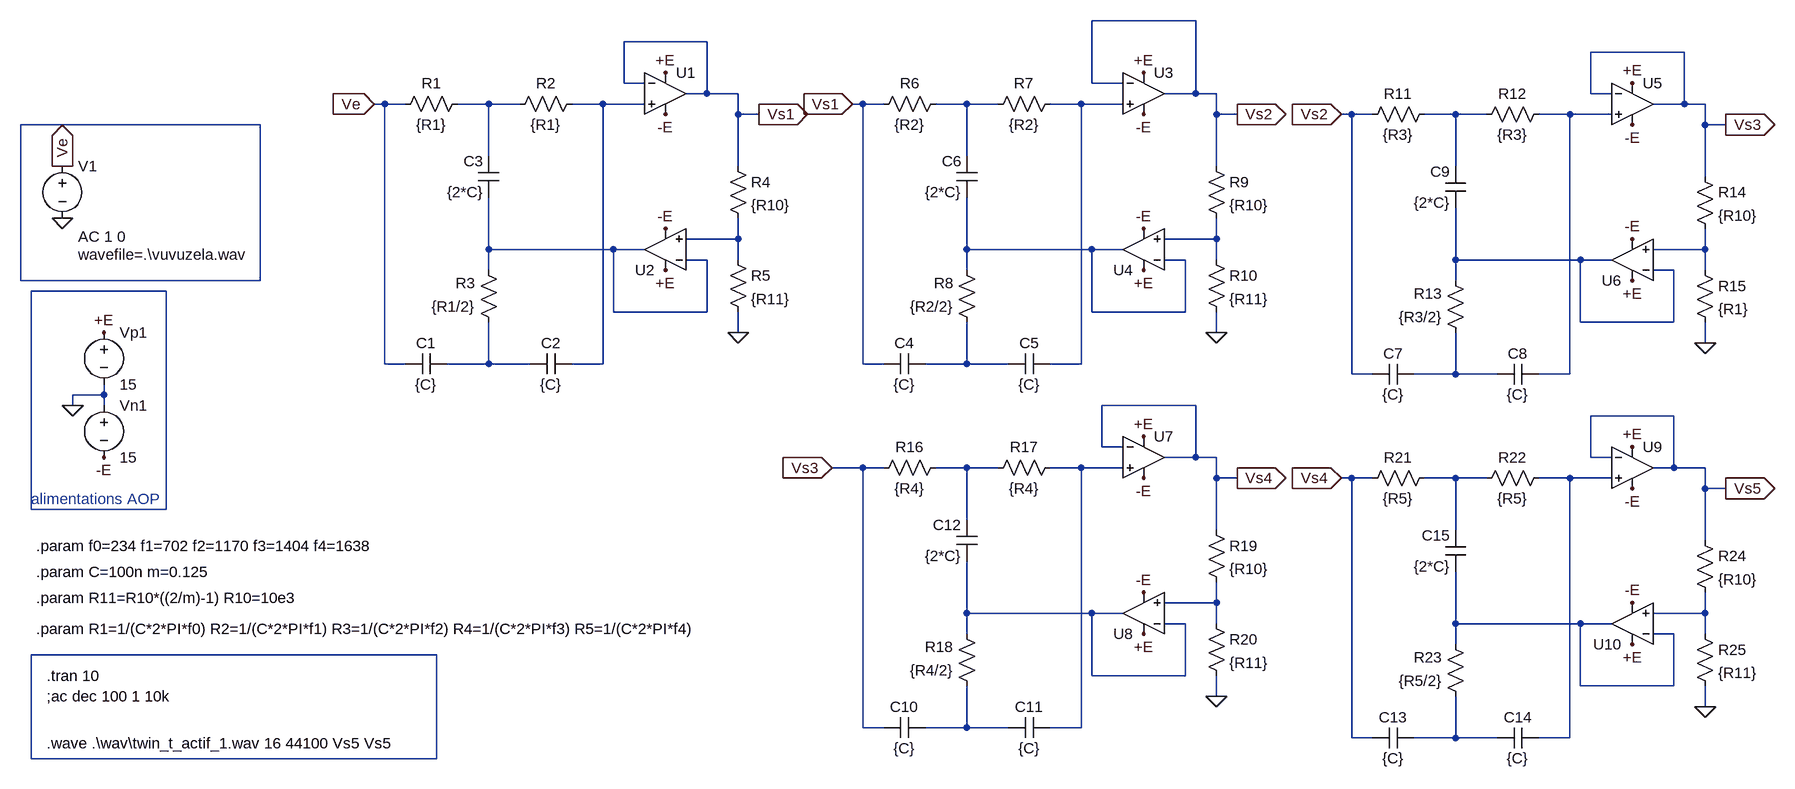
[diagram p0: schematic twin_t_actif.asc]
twin_t_actif.asc, the LTspice schematic file:
Version 4
SHEET 1 3028 888
WIRE 1712 -320 1552 -320
WIRE 960 -288 832 -288
WIRE 2464 -272 2320 -272
WIRE 832 -224 832 -288
WIRE 864 -224 832 -224
WIRE 1552 -224 1552 -320
WIRE 1600 -224 1552 -224
WIRE 960 -208 960 -288
WIRE 960 -208 928 -208
WIRE 1008 -208 960 -208
WIRE 1712 -208 1712 -320
WIRE 1712 -208 1664 -208
WIRE 1744 -208 1712 -208
WIRE 2320 -208 2320 -272
WIRE 2352 -208 2320 -208
WIRE 464 -192 448 -192
WIRE 496 -192 464 -192
WIRE 624 -192 576 -192
WIRE 672 -192 624 -192
WIRE 800 -192 752 -192
WIRE 864 -192 800 -192
WIRE 1200 -192 1184 -192
WIRE 1232 -192 1200 -192
WIRE 1360 -192 1312 -192
WIRE 1408 -192 1360 -192
WIRE 1536 -192 1488 -192
WIRE 1600 -192 1536 -192
WIRE 2464 -192 2464 -272
WIRE 2464 -192 2416 -192
WIRE 2496 -192 2464 -192
WIRE 1008 -176 1008 -208
WIRE 1040 -176 1008 -176
WIRE 1744 -176 1744 -208
WIRE 1776 -176 1744 -176
WIRE 1952 -176 1936 -176
WIRE 1984 -176 1952 -176
WIRE 2112 -176 2064 -176
WIRE 2160 -176 2112 -176
WIRE 2288 -176 2240 -176
WIRE 2352 -176 2288 -176
WIRE 272 -160 -96 -160
WIRE 2496 -160 2496 -192
WIRE 2528 -160 2496 -160
WIRE 624 -112 624 -192
WIRE 1360 -112 1360 -192
WIRE 1008 -96 1008 -176
WIRE 1744 -96 1744 -176
WIRE 2112 -96 2112 -176
WIRE 2496 -80 2496 -160
WIRE 1008 16 1008 -16
WIRE 1008 16 928 16
WIRE 1744 16 1744 -16
WIRE 1744 16 1664 16
WIRE 624 32 624 -48
WIRE 816 32 624 32
WIRE 864 32 816 32
WIRE 1360 32 1360 -48
WIRE 1552 32 1360 32
WIRE 1600 32 1552 32
WIRE 2496 32 2496 0
WIRE 2496 32 2416 32
WIRE 960 48 928 48
WIRE 1008 48 1008 16
WIRE 1696 48 1664 48
WIRE 1744 48 1744 16
WIRE 2112 48 2112 -32
WIRE 2304 48 2112 48
WIRE 2352 48 2304 48
WIRE 624 64 624 32
WIRE 1360 64 1360 32
WIRE 2448 64 2416 64
WIRE 2496 64 2496 32
WIRE -96 80 -96 -160
WIRE 272 80 272 -160
WIRE 272 80 -96 80
WIRE 2112 80 2112 48
WIRE 128 96 -80 96
WIRE 816 128 816 32
WIRE 960 128 960 48
WIRE 960 128 816 128
WIRE 1552 128 1552 32
WIRE 1696 128 1696 48
WIRE 1696 128 1552 128
WIRE 2304 144 2304 48
WIRE 2448 144 2448 64
WIRE 2448 144 2304 144
WIRE 1008 160 1008 128
WIRE 1744 160 1744 128
WIRE 2496 176 2496 144
WIRE 464 208 464 -192
WIRE 496 208 464 208
WIRE 624 208 624 144
WIRE 624 208 560 208
WIRE 688 208 624 208
WIRE 800 208 800 -192
WIRE 800 208 752 208
WIRE 1200 208 1200 -192
WIRE 1232 208 1200 208
WIRE 1360 208 1360 144
WIRE 1360 208 1296 208
WIRE 1424 208 1360 208
WIRE 1536 208 1536 -192
WIRE 1536 208 1488 208
WIRE 1952 224 1952 -176
WIRE 1984 224 1952 224
WIRE 2112 224 2112 160
WIRE 2112 224 2048 224
WIRE 2176 224 2112 224
WIRE 2288 224 2288 -176
WIRE 2288 224 2240 224
WIRE 32 256 32 240
WIRE 32 256 -16 256
WIRE -16 272 -16 256
WIRE 32 272 32 256
WIRE 1712 272 1568 272
WIRE 2448 288 2320 288
WIRE 1568 336 1568 272
WIRE 1600 336 1568 336
WIRE 1712 352 1712 272
WIRE 1712 352 1664 352
WIRE 1744 352 1712 352
WIRE 2320 352 2320 288
WIRE 2352 352 2320 352
WIRE 1200 368 1152 368
WIRE 1232 368 1200 368
WIRE 1360 368 1312 368
WIRE 1408 368 1360 368
WIRE 1536 368 1488 368
WIRE 1600 368 1536 368
WIRE 2448 368 2448 288
WIRE 2448 368 2416 368
WIRE 2496 368 2448 368
WIRE 1744 384 1744 352
WIRE 1776 384 1744 384
WIRE 1952 384 1936 384
WIRE 1984 384 1952 384
WIRE 2112 384 2064 384
WIRE 2160 384 2112 384
WIRE 2288 384 2240 384
WIRE 2352 384 2288 384
WIRE 2496 400 2496 368
WIRE 2528 400 2496 400
WIRE -80 432 -80 96
WIRE 128 432 128 96
WIRE 128 432 -80 432
WIRE 1360 448 1360 368
WIRE 1744 464 1744 384
WIRE 2112 464 2112 384
WIRE 2496 480 2496 400
WIRE 1744 576 1744 544
WIRE 1744 576 1664 576
WIRE 1360 592 1360 512
WIRE 1552 592 1360 592
WIRE 1600 592 1552 592
WIRE 2496 592 2496 560
WIRE 2496 592 2416 592
WIRE 1696 608 1664 608
WIRE 1744 608 1744 576
WIRE 2112 608 2112 528
WIRE 2304 608 2112 608
WIRE 2352 608 2304 608
WIRE 1360 624 1360 592
WIRE 2448 624 2416 624
WIRE 2496 624 2496 592
WIRE 2112 640 2112 608
WIRE 544 656 -80 656
WIRE 1552 688 1552 592
WIRE 1696 688 1696 608
WIRE 1696 688 1552 688
WIRE 2304 704 2304 608
WIRE 2448 704 2448 624
WIRE 2448 704 2304 704
WIRE 1744 720 1744 688
WIRE 2496 736 2496 704
WIRE 1200 768 1200 368
WIRE 1232 768 1200 768
WIRE 1360 768 1360 704
WIRE 1360 768 1296 768
WIRE 1424 768 1360 768
WIRE 1536 768 1536 368
WIRE 1536 768 1488 768
WIRE 1952 784 1952 384
WIRE 1984 784 1952 784
WIRE 2112 784 2112 720
WIRE 2112 784 2048 784
WIRE 2176 784 2112 784
WIRE 2288 784 2288 384
WIRE 2288 784 2240 784
WIRE -80 816 -80 656
WIRE 544 816 544 656
WIRE 544 816 -80 816
FLAG -32 -16 0
FLAG -32 -96 Ve
IOPIN -32 -96 Out
FLAG 896 -240 +E
FLAG 896 -176 -E
FLAG 896 64 +E
FLAG 896 0 -E
FLAG 1008 160 0
FLAG 448 -192 Ve
IOPIN 448 -192 In
FLAG 1040 -176 Vs1
IOPIN 1040 -176 Out
FLAG -16 272 0
FLAG 32 160 +E
FLAG 32 352 -E
FLAG 1632 -240 +E
FLAG 1632 -176 -E
FLAG 1632 64 +E
FLAG 1632 0 -E
FLAG 1744 160 0
FLAG 1184 -192 Vs1
IOPIN 1184 -192 In
FLAG 1776 -176 Vs2
IOPIN 1776 -176 Out
FLAG 2384 -224 +E
FLAG 2384 -160 -E
FLAG 2384 80 +E
FLAG 2384 16 -E
FLAG 2496 176 0
FLAG 1936 -176 Vs2
IOPIN 1936 -176 In
FLAG 2528 -160 Vs3
IOPIN 2528 -160 Out
FLAG 1632 320 +E
FLAG 1632 384 -E
FLAG 1632 624 +E
FLAG 1632 560 -E
FLAG 1744 720 0
FLAG 1152 368 Vs3
IOPIN 1152 368 In
FLAG 1776 384 Vs4
IOPIN 1776 384 Out
FLAG 2384 336 +E
FLAG 2384 400 -E
FLAG 2384 640 +E
FLAG 2384 576 -E
FLAG 2496 736 0
FLAG 1936 384 Vs4
IOPIN 1936 384 In
FLAG 2528 400 Vs5
IOPIN 2528 400 Out
SYMBOL voltage -32 -112 R0
WINDOW 3 24 152 Left 2
WINDOW 123 24 124 Left 2
WINDOW 39 0 0 Left 0
SYMATTR Value wavefile=.\vuvuzela.wav
SYMATTR Value2 AC 1 0
SYMATTR InstName V1
SYMBOL res 592 -208 R90
WINDOW 0 0 56 VBottom 2
WINDOW 3 32 56 VTop 2
SYMATTR InstName R1
SYMATTR Value {R1}
SYMBOL res 768 -208 R90
WINDOW 0 0 56 VBottom 2
WINDOW 3 32 56 VTop 2
SYMATTR InstName R2
SYMATTR Value {R1}
SYMBOL res 640 160 R180
WINDOW 0 36 76 Left 2
WINDOW 3 36 40 Left 2
SYMATTR InstName R3
SYMATTR Value {R1/2}
SYMBOL cap 560 192 R90
WINDOW 0 0 32 VBottom 2
WINDOW 3 32 32 VTop 2
SYMATTR InstName C1
SYMATTR Value {C}
SYMBOL cap 752 192 R90
WINDOW 0 0 32 VBottom 2
WINDOW 3 32 32 VTop 2
SYMATTR InstName C2
SYMATTR Value {C}
SYMBOL cap 640 -48 R180
WINDOW 0 24 56 Left 2
WINDOW 3 24 8 Left 2
SYMATTR InstName C3
SYMATTR Value {2*C}
SYMBOL Opamps\\UniversalOpamp2 896 -208 R0
SYMATTR InstName U1
SYMBOL Opamps\\UniversalOpamp2 896 32 R180
SYMATTR InstName U2
SYMBOL res 992 -112 R0
SYMATTR InstName R4
SYMATTR Value {R10}
SYMBOL res 992 32 R0
SYMATTR InstName R5
SYMATTR Value {R11}
SYMBOL voltage 32 144 R0
WINDOW 123 0 0 Left 2
WINDOW 39 0 0 Left 2
SYMATTR InstName Vp1
SYMATTR Value 15
SYMBOL voltage 32 256 R0
WINDOW 123 0 0 Left 2
WINDOW 39 0 0 Left 2
SYMATTR InstName Vn1
SYMATTR Value 15
SYMBOL res 1328 -208 R90
WINDOW 0 0 56 VBottom 2
WINDOW 3 32 56 VTop 2
SYMATTR InstName R6
SYMATTR Value {R2}
SYMBOL res 1504 -208 R90
WINDOW 0 0 56 VBottom 2
WINDOW 3 32 56 VTop 2
SYMATTR InstName R7
SYMATTR Value {R2}
SYMBOL res 1376 160 R180
WINDOW 0 36 76 Left 2
WINDOW 3 36 40 Left 2
SYMATTR InstName R8
SYMATTR Value {R2/2}
SYMBOL cap 1296 192 R90
WINDOW 0 0 32 VBottom 2
WINDOW 3 32 32 VTop 2
SYMATTR InstName C4
SYMATTR Value {C}
SYMBOL cap 1488 192 R90
WINDOW 0 0 32 VBottom 2
WINDOW 3 32 32 VTop 2
SYMATTR InstName C5
SYMATTR Value {C}
SYMBOL cap 1376 -48 R180
WINDOW 0 24 56 Left 2
WINDOW 3 24 8 Left 2
SYMATTR InstName C6
SYMATTR Value {2*C}
SYMBOL Opamps\\UniversalOpamp2 1632 -208 R0
SYMATTR InstName U3
SYMBOL Opamps\\UniversalOpamp2 1632 32 R180
SYMATTR InstName U4
SYMBOL res 1728 -112 R0
SYMATTR InstName R9
SYMATTR Value {R10}
SYMBOL res 1728 32 R0
SYMATTR InstName R10
SYMATTR Value {R11}
SYMBOL res 2080 -192 R90
WINDOW 0 0 56 VBottom 2
WINDOW 3 32 56 VTop 2
SYMATTR InstName R11
SYMATTR Value {R3}
SYMBOL res 2256 -192 R90
WINDOW 0 0 56 VBottom 2
WINDOW 3 32 56 VTop 2
SYMATTR InstName R12
SYMATTR Value {R3}
SYMBOL res 2128 176 R180
WINDOW 0 36 76 Left 2
WINDOW 3 36 40 Left 2
SYMATTR InstName R13
SYMATTR Value {R3/2}
SYMBOL cap 2048 208 R90
WINDOW 0 0 32 VBottom 2
WINDOW 3 32 32 VTop 2
SYMATTR InstName C7
SYMATTR Value {C}
SYMBOL cap 2240 208 R90
WINDOW 0 0 32 VBottom 2
WINDOW 3 32 32 VTop 2
SYMATTR InstName C8
SYMATTR Value {C}
SYMBOL cap 2128 -32 R180
WINDOW 0 24 56 Left 2
WINDOW 3 24 8 Left 2
SYMATTR InstName C9
SYMATTR Value {2*C}
SYMBOL Opamps\\UniversalOpamp2 2384 -192 R0
SYMATTR InstName U5
SYMBOL Opamps\\UniversalOpamp2 2384 48 R180
SYMATTR InstName U6
SYMBOL res 2480 -96 R0
SYMATTR InstName R14
SYMATTR Value {R10}
SYMBOL res 2480 48 R0
SYMATTR InstName R15
SYMATTR Value {R1}
SYMBOL res 1328 352 R90
WINDOW 0 0 56 VBottom 2
WINDOW 3 32 56 VTop 2
SYMATTR InstName R16
SYMATTR Value {R4}
SYMBOL res 1504 352 R90
WINDOW 0 0 56 VBottom 2
WINDOW 3 32 56 VTop 2
SYMATTR InstName R17
SYMATTR Value {R4}
SYMBOL res 1376 720 R180
WINDOW 0 36 76 Left 2
WINDOW 3 36 40 Left 2
SYMATTR InstName R18
SYMATTR Value {R4/2}
SYMBOL cap 1296 752 R90
WINDOW 0 0 32 VBottom 2
WINDOW 3 32 32 VTop 2
SYMATTR InstName C10
SYMATTR Value {C}
SYMBOL cap 1488 752 R90
WINDOW 0 0 32 VBottom 2
WINDOW 3 32 32 VTop 2
SYMATTR InstName C11
SYMATTR Value {C}
SYMBOL cap 1376 512 R180
WINDOW 0 24 56 Left 2
WINDOW 3 24 8 Left 2
SYMATTR InstName C12
SYMATTR Value {2*C}
SYMBOL Opamps\\UniversalOpamp2 1632 352 R0
SYMATTR InstName U7
SYMBOL Opamps\\UniversalOpamp2 1632 592 R180
SYMATTR InstName U8
SYMBOL res 1728 448 R0
SYMATTR InstName R19
SYMATTR Value {R10}
SYMBOL res 1728 592 R0
SYMATTR InstName R20
SYMATTR Value {R11}
SYMBOL res 2080 368 R90
WINDOW 0 0 56 VBottom 2
WINDOW 3 32 56 VTop 2
SYMATTR InstName R21
SYMATTR Value {R5}
SYMBOL res 2256 368 R90
WINDOW 0 0 56 VBottom 2
WINDOW 3 32 56 VTop 2
SYMATTR InstName R22
SYMATTR Value {R5}
SYMBOL res 2128 736 R180
WINDOW 0 36 76 Left 2
WINDOW 3 36 40 Left 2
SYMATTR InstName R23
SYMATTR Value {R5/2}
SYMBOL cap 2048 768 R90
WINDOW 0 0 32 VBottom 2
WINDOW 3 32 32 VTop 2
SYMATTR InstName C13
SYMATTR Value {C}
SYMBOL cap 2240 768 R90
WINDOW 0 0 32 VBottom 2
WINDOW 3 32 32 VTop 2
SYMATTR InstName C14
SYMATTR Value {C}
SYMBOL cap 2128 528 R180
WINDOW 0 24 56 Left 2
WINDOW 3 24 8 Left 2
SYMATTR InstName C15
SYMATTR Value {2*C}
SYMBOL Opamps\\UniversalOpamp2 2384 368 R0
SYMATTR InstName U9
SYMBOL Opamps\\UniversalOpamp2 2384 608 R180
SYMATTR InstName U10
SYMBOL res 2480 464 R0
SYMATTR InstName R24
SYMATTR Value {R10}
SYMBOL res 2480 608 R0
SYMATTR InstName R25
SYMATTR Value {R11}
TEXT -56 688 Left 2 !.tran 10
TEXT -72 528 Left 2 !.param C=100n m=0.125
TEXT -72 568 Left 2 !.param R11=R10*((2/m)-1) R10=10e3
TEXT -56 720 Left 2 !;ac dec 100 1 10k
TEXT -56 792 Left 2 !.wave .\\wav\\twin_t_actif_1.wav 16 44100 Vs5 Vs5
TEXT -80 416 Left 2 ;alimentations AOP
TEXT -72 488 Left 2 !.param f0=234 f1=702 f2=1170 f3=1404 f4=1638
TEXT -72 616 Left 2 !.param R1=1/(C*2*PI*f0) R2=1/(C*2*PI*f1) R3=1/(C*2*PI*f2) R4=1/(C*2*PI*f3) R5=1/(C*2*PI*f4)

The netlist it stands for:
* twin_t_actif.asc
V1 Ve 0 wavefile=.\vuvuzela.wav AC 1 0
R1 N001 Ve {R1}
R2 N002 N001 {R1}
R3 N015 N010 {R1/2}
C1 N015 Ve {C}
C2 N002 N015 {C}
C3 N010 N001 {2*C}
XU1 N002 Vs1 +E -E Vs1 level.2 Avol=1Meg GBW=10Meg Slew=10Meg ilimit=25m rail=0 Vos=0 phimargin=45 en=0 enk=0 in=0 ink=0 Rin=500Meg  ; pins IN+ IN- V+ V- OUT
XU2 N008 N010 +E -E N010 level.2 Avol=1Meg GBW=10Meg Slew=10Meg ilimit=25m rail=0 Vos=0 phimargin=45 en=0 enk=0 in=0 ink=0 Rin=500Meg  ; pins IN+ IN- V+ V- OUT
R4 Vs1 N008 {R10}
R5 N008 0 {R11}
Vp1 +E 0 15
Vn1 0 -E 15
R6 N003 Vs1 {R2}
R7 N004 N003 {R2}
R8 N016 N011 {R2/2}
C4 N016 Vs1 {C}
C5 N004 N016 {C}
C6 N011 N003 {2*C}
XU3 N004 Vs2 +E -E Vs2 level.2 Avol=1Meg GBW=10Meg Slew=10Meg ilimit=25m rail=0 Vos=0 phimargin=45 en=0 enk=0 in=0 ink=0 Rin=500Meg  ; pins IN+ IN- V+ V- OUT
XU4 N009 N011 +E -E N011 level.2 Avol=1Meg GBW=10Meg Slew=10Meg ilimit=25m rail=0 Vos=0 phimargin=45 en=0 enk=0 in=0 ink=0 Rin=500Meg  ; pins IN+ IN- V+ V- OUT
R9 Vs2 N009 {R10}
R10 N009 0 {R11}
R11 N005 Vs2 {R3}
R12 N006 N005 {R3}
R13 N017 N013 {R3/2}
C7 N017 Vs2 {C}
C8 N006 N017 {C}
C9 N013 N005 {2*C}
XU5 N006 Vs3 +E -E Vs3 level.2 Avol=1Meg GBW=10Meg Slew=10Meg ilimit=25m rail=0 Vos=0 phimargin=45 en=0 enk=0 in=0 ink=0 Rin=500Meg  ; pins IN+ IN- V+ V- OUT
XU6 N012 N013 +E -E N013 level.2 Avol=1Meg GBW=10Meg Slew=10Meg ilimit=25m rail=0 Vos=0 phimargin=45 en=0 enk=0 in=0 ink=0 Rin=500Meg  ; pins IN+ IN- V+ V- OUT
R14 Vs3 N012 {R10}
R15 N012 0 {R1}
R16 N018 Vs3 {R4}
R17 N019 N018 {R4}
R18 N027 N023 {R4/2}
C10 N027 Vs3 {C}
C11 N019 N027 {C}
C12 N023 N018 {2*C}
XU7 N019 Vs4 +E -E Vs4 level.2 Avol=1Meg GBW=10Meg Slew=10Meg ilimit=25m rail=0 Vos=0 phimargin=45 en=0 enk=0 in=0 ink=0 Rin=500Meg  ; pins IN+ IN- V+ V- OUT
XU8 N022 N023 +E -E N023 level.2 Avol=1Meg GBW=10Meg Slew=10Meg ilimit=25m rail=0 Vos=0 phimargin=45 en=0 enk=0 in=0 ink=0 Rin=500Meg  ; pins IN+ IN- V+ V- OUT
R19 Vs4 N022 {R10}
R20 N022 0 {R11}
R21 N020 Vs4 {R5}
R22 N021 N020 {R5}
R23 N028 N025 {R5/2}
C13 N028 Vs4 {C}
C14 N021 N028 {C}
C15 N025 N020 {2*C}
XU9 N021 Vs5 +E -E Vs5 level.2 Avol=1Meg GBW=10Meg Slew=10Meg ilimit=25m rail=0 Vos=0 phimargin=45 en=0 enk=0 in=0 ink=0 Rin=500Meg  ; pins IN+ IN- V+ V- OUT
XU10 N024 N025 +E -E N025 level.2 Avol=1Meg GBW=10Meg Slew=10Meg ilimit=25m rail=0 Vos=0 phimargin=45 en=0 enk=0 in=0 ink=0 Rin=500Meg  ; pins IN+ IN- V+ V- OUT
R24 Vs5 N024 {R10}
R25 N024 0 {R11}
.tran 10
.param C=100n m=0.125
.param R11=R10*((2/m)-1) R10=10e3
;ac dec 100 1 10k
.wave .\wav\twin_t_actif_1.wav 16 44100 Vs5 Vs5
* alimentations AOP
.param f0=234 f1=702 f2=1170 f3=1404 f4=1638
.param R1=1/(C*2*PI*f0) R2=1/(C*2*PI*f1) R3=1/(C*2*PI*f2) R4=1/(C*2*PI*f3) R5=1/(C*2*PI*f4)
.lib UniversalOpamps2.sub
.backanno
.end